# EAGLE design Diff_AMP (EAGLE 9.6.2)
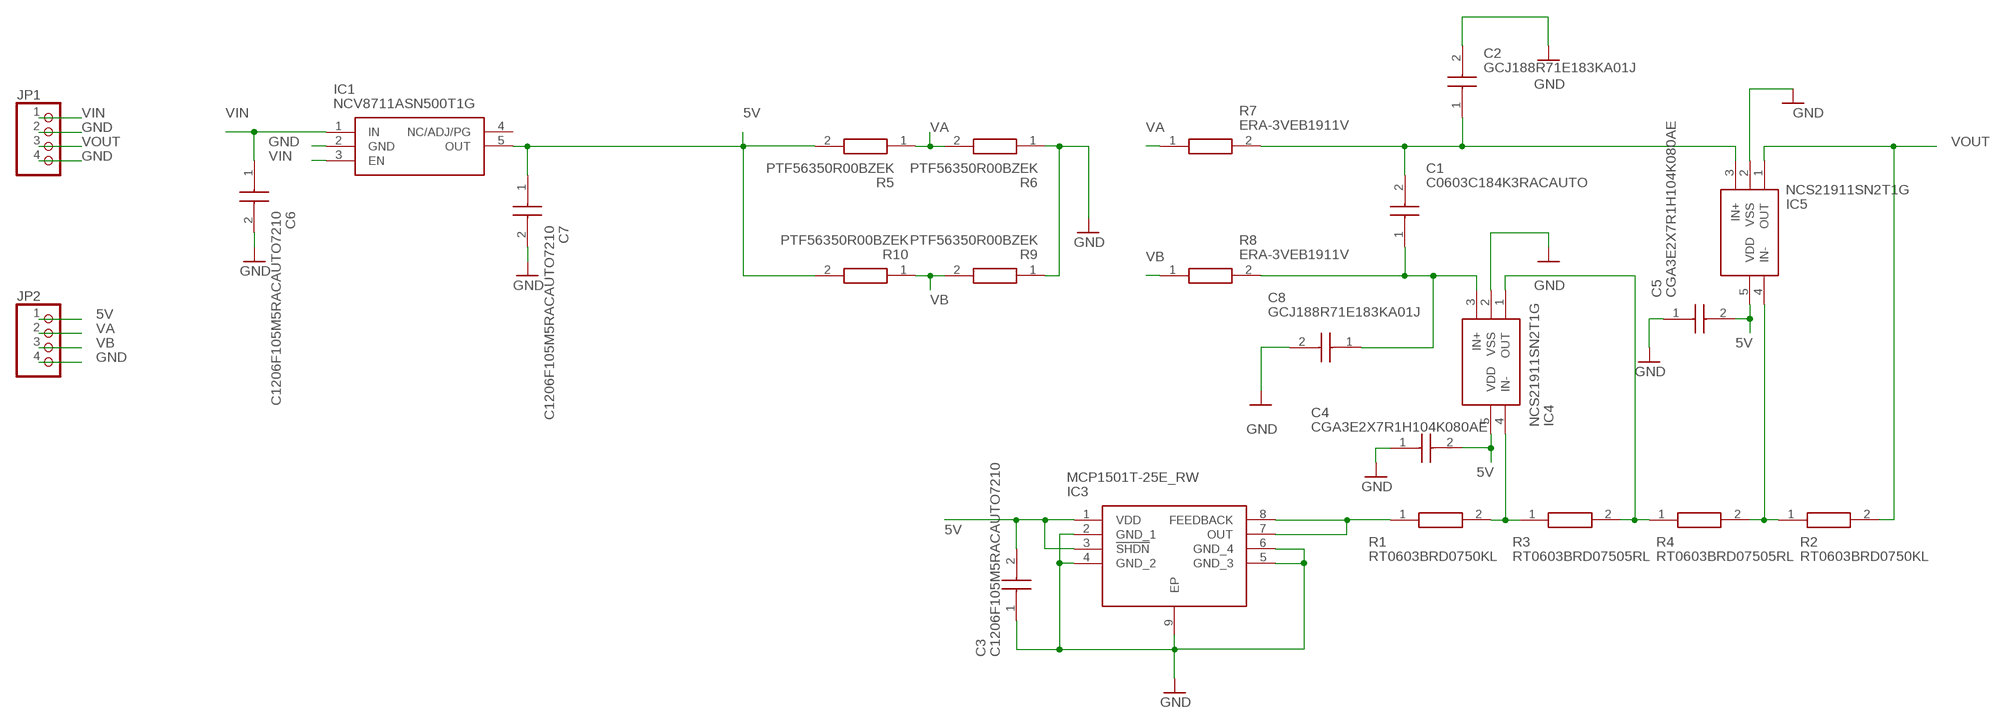
[diagram p0: schematic, sheet 1]

## Parts
C1  C0603C184K3RACAUTO  [C0603]
C2  GCJ188R71E183KA01J  [CAPC1608X100N]
C3  C1206F105M5RACAUTO7210  [C1206]
C4  CGA3E2X7R1H104K080AE  [CAPC1608X90N]
C5  CGA3E2X7R1H104K080AE  [CAPC1608X90N]
C6  C1206F105M5RACAUTO7210  [C1206]
C7  C1206F105M5RACAUTO7210  [C1206]
C8  GCJ188R71E183KA01J  [CAPC1608X100N]
IC1  NCV8711ASN500T1G  [SOT95P275X110-5N]
IC3  MCP1501T-25E_RW  [SON50P200X200X80-9N]
IC4  NCS21911SN2T1G  [SOT95P275X110-5N]
IC5  NCS21911SN2T1G  [SOT95P275X110-5N]
JP1  PINHD-1X4  [1X04]
JP2  PINHD-1X4  [1X04]
R1  RT0603BRD0750KL  [RESC1608X55N]
R2  RT0603BRD0750KL  [RESC1608X55N]
R3  RT0603BRD07505RL  [RESC1608X55N]
R4  RT0603BRD07505RL  [RESC1608X55N]
R5  PTF56350R00BZEK  [RESAD1559W64L635D231]
R6  PTF56350R00BZEK  [RESAD1559W64L635D231]
R7  ERA-3VEB1911V  [ERA3KV_(0603)]
R8  ERA-3VEB1911V  [ERA3KV_(0603)]
R9  PTF56350R00BZEK  [RESAD1559W64L635D231]
R10  PTF56350R00BZEK  [RESAD1559W64L635D231]

## Nets
5V: C3.2 C4.2 C5.2 C7.1 IC1.5(OUT) IC3.1(VDD) IC3.3(!SHDN) IC4.5(VDD) IC5.5(VDD) JP2.1 R5.2 R10.2
GND: C2.2 C3.1 C4.1 C5.1 C6.2 C7.2 C8.2 IC1.2(GND) IC3.2(GND_1) IC3.4(GND_2) IC3.5(GND_3) IC3.6(GND_4) IC3.9(EP) IC4.2(VSS) IC5.2(VSS) JP1.2 JP1.4 JP2.4 R6.1 R9.1
N$1: IC3.7(OUT) IC3.8(FEEDBACK) R1.1
N$2: IC4.4(IN-) R1.2 R3.1
N$3: C1.1 C8.1 IC4.3(IN+) R8.2
N$9: C1.2 C2.1 IC5.3(IN+) R7.2
N$12: IC4.1(OUT) R3.2 R4.1
N$13: IC5.4(IN-) R2.1 R4.2
VA: JP2.2 R5.1 R6.2 R7.1
VB: JP2.3 R8.1 R9.2 R10.1
VIN: C6.1 IC1.1(IN) IC1.3(EN) JP1.1
VOUT: IC5.1(OUT) JP1.3 R2.2
Unconnected: IC1.4(NC/ADJ/PG)

## Library data of the parts
C1 = SamacSys_Parts:C0603C184K3RACAUTO: SMD Auto X7R, Ceramic, 0.18 uF, 10%, 25 VDC, 62.5 VDC, 125?C, -55?C, X7R, SMD, MLCC, Temperature Stable, Automotive Grade, 3.5 % , 2.7778 GOhms, 4.8 mg, 0603, 1.6mm, 0.8mm, 0.8mm, 0.7mm, 0.35mm, 4000, 78 Weeks, 80 Source: Datasheet <https://content.kemet.com/datasheets/KEM_C1023_X7R_AUTO_SMD.pdf>; DESCRIPTION: SMD Auto X7R, Ceramic, 0.18 uF, 10%, 25 VDC, 62.5 VDC, 125?C, -55?C, X7R, SMD, MLCC, Temperature Stable, Automotive Grade, 3.5 % , 2.7778 GOhms, 4.8 mg, 0603, 1.6mm, 0.8mm, 0.8mm, 0.7mm, 0.35mm, 4000, 78 Weeks, 80; HEIGHT: 0.87mm; MANUFACTURER_NAME: KEMET; MANUFACTURER_PART_NUMBER: C0603C184K3RACAUTO; MOUSER_PART_NUMBER: 80-C0603C184K3RAUTO; MOUSER_PRICE-STOCK: https://www.mouser.co.uk/ProductDetail/KEMET/C0603C184K3RACAUTO?qs=u4fy%2FsgLU9MEpDJmNL66Jg%3D%3D
C2 C8 = SamacSys_Parts:GCJ188R71E183KA01J: Capacitor GCJ18 L=1.6mm W=0.8mm T=0.8mm Source: Datasheet <https://componentsearchengine.com/Datasheets/1/GCJ188R71E183KA01J.pdf>; DESCRIPTION: Capacitor GCJ18 L=1.6mm W=0.8mm T=0.8mm; HEIGHT: 1mm; MANUFACTURER_NAME: Murata Electronics; MANUFACTURER_PART_NUMBER: GCJ188R71E183KA01J; MOUSER_PART_NUMBER: 81-GCJ188R71E183KA1J; MOUSER_PRICE-STOCK: https://www.mouser.com/Search/Refine.aspx?Keyword=81-GCJ188R71E183KA1J
C3 C6 C7 = SamacSys_Parts:C1206F105M5RACAUTO7210: SMD Auto X7R FO, Ceramic, 1 uF, 20%, 50 VDC, 125 VDC, 125?C, -55?C, X7R, SMD, MLCC, Open Mode, Automotive Grade, 2.5 % , 500 MOhms, 41 mg, 1206, 3.2mm, 1.6mm, 1.6mm, 0.5mm, 8000, 78 Weeks, 80 Source: Datasheet <https://content.kemet.com/datasheets/KEM_C1012_X7R_OPENMODE_SMD.pdf>; DESCRIPTION: SMD Auto X7R FO, Ceramic, 1 uF, 20%, 50 VDC, 125 VDC, 125?C, -55?C, X7R, SMD, MLCC, Open Mode, Automotive Grade, 2.5 % , 500 MOhms, 41 mg, 1206, 3.2mm, 1.6mm, 1.6mm, 0.5mm, 8000, 78 Weeks, 80; HEIGHT: mm; MANUFACTURER_NAME: KEMET; MANUFACTURER_PART_NUMBER: C1206F105M5RACAUTO7210; MOUSER_PART_NUMBER: 80-C1206F105M5RAUTLR; MOUSER_PRICE-STOCK: https://www.mouser.co.uk/ProductDetail/KEMET/C1206F105M5RACAUTO7210?qs=ds50AKTGxA8F1MxATCT6sg%3D%3D
C4 C5 = SamacSys_Parts:CGA3E2X7R1H104K080AE: Source: Datasheet; HEIGHT: 0.9mm; MANUFACTURER_NAME: TDK; MANUFACTURER_PART_NUMBER: CGA3E2X7R1H104K080AE; MOUSER_PART_NUMBER: 810-CGA3E2X7R1H104KE; MOUSER_PRICE-STOCK: https://www.mouser.co.uk/ProductDetail/TDK/CGA3E2X7R1H104K080AE?qs=n%2FVzw7c4a0kvajqFvEbDzQ%3D%3D
IC1 = SamacSys_Parts:NCV8711ASN500T1G: LDO Voltage Regulators NCV8711 TSOP-5 5V0 Source: Datasheet <https://www.onsemi.com/pdf/datasheet/ncv8711-d.pdf>; DESCRIPTION: LDO Voltage Regulators NCV8711 TSOP-5 5V0; HEIGHT: 1.1mm; MANUFACTURER_NAME: onsemi; MANUFACTURER_PART_NUMBER: NCV8711ASN500T1G; MOUSER_PART_NUMBER: 863-NCV8711ASN500T1G; MOUSER_PRICE-STOCK: https://www.mouser.co.uk/ProductDetail/onsemi/NCV8711ASN500T1G?qs=W%2FMpXkg%252BdQ7j9dl81WfXeA%3D%3D
IC3 = SamacSys_Parts:MCP1501T-25E_RW: Voltage References High Prec Buffered Voltage Reference Source: Datasheet <http://ww1.microchip.com/downloads/en/DeviceDoc/20005474E.pdf>; DESCRIPTION: Voltage References High Prec Buffered Voltage Reference; HEIGHT: 0.8mm; MANUFACTURER_NAME: Microchip; MANUFACTURER_PART_NUMBER: MCP1501T-25E/RW; MOUSER_PART_NUMBER: 579-MCP1501T-25E/RW; MOUSER_PRICE-STOCK: https://www.mouser.co.uk/ProductDetail/Microchip-Technology/MCP1501T-25E-RW?qs=BA62vJVifGo7hml43fG32Q%3D%3D
IC4 IC5 = SamacSys_Parts:NCS21911SN2T1G: Operational Amplifiers - Op Amps 2 MHz Source: Datasheet <https://www.arrow.com/en/products/ncs21911sn2t1g/on-semiconductor>; DESCRIPTION: Operational Amplifiers - Op Amps 2 MHz; HEIGHT: 1.1mm; MANUFACTURER_NAME: ON Semiconductor; MANUFACTURER_PART_NUMBER: NCS21911SN2T1G; MOUSER_PART_NUMBER: 863-NCS21911SN2T1G; MOUSER_PRICE-STOCK: https://www.mouser.co.uk/ProductDetail/ON-Semiconductor/NCS21911SN2T1G/?qs=%252B6g0mu59x7Ix%2FTFBhvJ5Cw%3D%3D
JP1 JP2 = pinhead:PINHD-1X4: PIN HEADER
R1 R2 = SamacSys_Parts:RT0603BRD0750KL: Thin Film Resistors - SMD 50K ohm 0.1% 25 ppm High-Precision Source: Datasheet; DESCRIPTION: Thin Film Resistors - SMD 50K ohm 0.1% 25 ppm High-Precision; HEIGHT: 0.55mm; MANUFACTURER_NAME: KEMET; MANUFACTURER_PART_NUMBER: RT0603BRD0750KL; MOUSER_PART_NUMBER: 603-RT0603BRD0750KL; MOUSER_PRICE-STOCK: https://www.mouser.co.uk/ProductDetail/YAGEO/RT0603BRD0750KL?qs=qpJ%252B%252B%252Bdg6p2%2FJCmrad8NSA%3D%3D
R3 R4 = SamacSys_Parts:RT0603BRD07505RL: Thin Film Resistors - SMD 505 ohm 0.1% 25 ppm High-Precision Source: Datasheet; DESCRIPTION: Thin Film Resistors - SMD 1/10W 505 Ohms 0.1%; HEIGHT: 0.45 mm; MANUFACTURER_NAME: YAGEO; MANUFACTURER_PART_NUMBER: RT0603BRD07505RL; MOUSER_PART_NUMBER: 603-RT0603BRD07505RL; MOUSER_PRICE-STOCK: https://www.mouser.com/ProductDetail/YAGEO/RT0603BRD07505RL?qs=%2Ff7pOCXLR5cBSiUnANXXqg%3D%3D
R5 R6 R9 R10 = SamacSys_Parts:PTF56350R00BZEK: Vishay PTF56 Series Axial Metal Film Resistor 350 +/-0.1% 0.125W +/-5ppm/C Source: Datasheet <https://componentsearchengine.com/Datasheets/1/PTF56350R00BZEK.pdf>; DESCRIPTION: Vishay PTF56 Series Axial Metal Film Resistor 350 +/-0.1% 0.125W +/-5ppm/C; HEIGHT: mm; MANUFACTURER_NAME: Vishay; MANUFACTURER_PART_NUMBER: PTF56350R00BZEK; MOUSER_PART_NUMBER: 71-PTF56350R00BZEK; MOUSER_PRICE-STOCK: https://www.mouser.com/Search/Refine.aspx?Keyword=71-PTF56350R00BZEK
R7 R8 = SamacSys_Parts:ERA-3VEB1911V: Chip Resistor 0603 (1608 Metric) Anti-Sulfur, Automotive AEC-Q200 Thin Film Source: Datasheet <http://industrial.panasonic.com/cdbs/www-data/pdf/RDM0000/RDM0000C331.pdf>; DESCRIPTION: Chip Resistor 0603 (1608 Metric) Anti-Sulfur, Automotive AEC-Q200 Thin Film; HEIGHT: 0.4mm; MANUFACTURER_NAME: Panasonic; MANUFACTURER_PART_NUMBER: ERA-3VEB1911V; MOUSER_PART_NUMBER: 667-ERA-3VEB1911V; MOUSER_PRICE-STOCK: https://www.mouser.co.uk/ProductDetail/Panasonic/ERA-3VEB1911V?qs=OlC7AqGiEDmVeEFNDv62ZQ%3D%3D

## Board
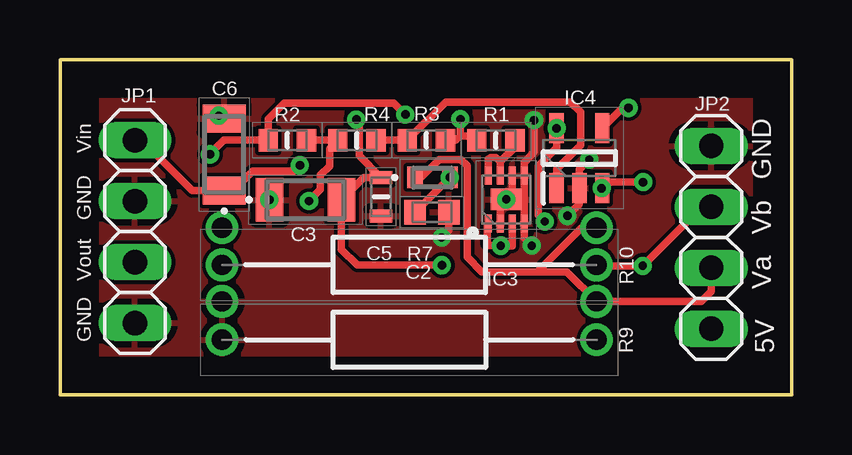
[diagram p1: board, top side]
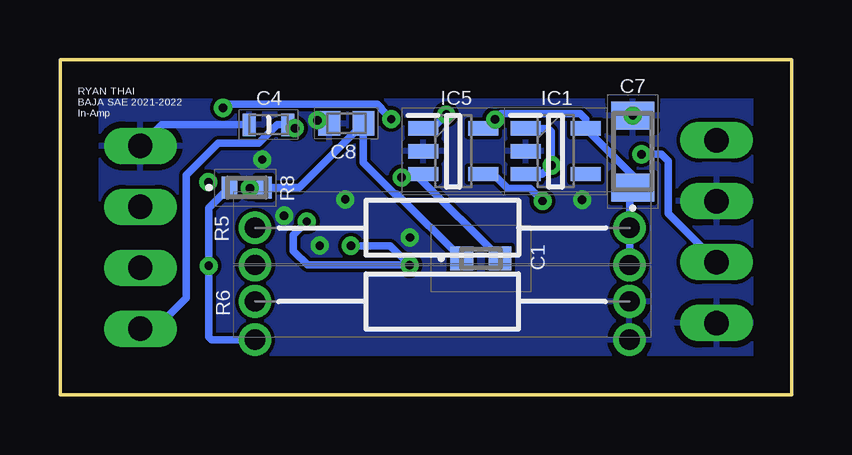
[diagram p2: board, bottom side, seen from below]

Size 30.48 x 13.97 mm. Coordinates in mm from the lower left corner, seen from the top.
Outline: 0,0 30.48,0 30.48,13.97 0,13.97 0,0
Copper layers (1*16): Top 0.035mm / dielectric 1.5mm / Bottom 0.035mm
Design rules "default *": minimum track width 6mil, minimum drill 0.35mm, track to track 6mil, track to pad 6mil, pad to pad 6mil, via to via 6mil, smd to smd 6mil, copper to edge 60mil, drill to drill 6mil, minimum pad ring 10mil, minimum via ring 8mil, stop-mask expansion 4mil, vias tented up to drill 20mil, thermal gap 10mil

### Footprints (pad centres in the part's own frame; a part is rotated, then mirrored left to right if it is on the bottom)
C0603 = smd 0.95 x 1: 1 -0.8,0; 2 0.8,0
CAPC1608X100N = smd 0.9 x 1.02: 1 -0.71,0; 2 0.71,0
C1206 = smd 1.15 x 1.8: 1 -1.5,0; 2 1.5,0
CAPC1608X90N = smd 0.54 x 0.94: 1 -0.8,0; 2 0.8,0
SOT95P275X110-5N = smd 1.25 x 0.6: 1 -1.25,0.95; 2 -1.25,0; 3 -1.25,-0.95; 4 1.25,-0.95; 5 1.25,0.95
SON50P200X200X80-9N = smd 0.75 x 0.3: 1 -1,0.75; 2 -1,0.25; 3 -1,-0.25; 4 -1,-0.75; 5 1,-0.75; 6 1,-0.25; 7 1,0.25; 8 1,0.75 | smd 0.9 x 1.3: 9 0,0
1X04 = drill 1.016 long: 1 -3.81,0; 2 -1.27,0; 3 1.27,0; 4 3.81,0
RESC1608X55N = smd 0.8 x 0.95: 1 -0.8,0; 2 0.8,0
RESAD1559W64L635D231 = drill 0.85 pad 1.275: 1 0,0; 2 15.6,0
ERA3KV_(0603) = smd 0.65 x 0.9: 1 -0.725,-0.025; 2 0.725,-0.025

### Placement (x,y rotation side)
C1  12.95,5.69 0 bottom
C2  15.49,7.62 0 top
C3  10.23,8.14 0 top
C4  21.79,11.27 0 bottom
C5  13.37,8.26 90 top
C6  6.84,10.02 90 top
C7  6.62,10.15 90 bottom
C8  18.55,11.32 180 bottom
IC1  9.83,10.16 0 bottom
IC3  18.59,8.15 90 top
IC4  21.64,9.87 90 top
IC5  14.1,10.16 0 bottom
JP1  3.12,6.81 270 top
JP2  27.13,6.57 90 top
R1  18.16,10.62 180 top
R2  9.47,10.62 180 top
R3  15.27,10.62 180 top
R4  12.37,10.62 180 top
R5  22.35,6.97 0 bottom
R6  6.75,3.9 180 bottom
R7  15.52,9.09 0 top
R8  22.7,8.67 0 bottom
R9  6.75,2.3 0 top
R10  22.35,5.42 180 top

### Tracks (layer width: path | path; a pad name or v marks a point on that pad's centre or on a via)
5V  (via drill 0.35)
  Top 0.305: v12.35,11.49 12.35,11.34 12.46,11.22 12.46,9.97 C5.2 12.65,9.06 C3.2 11.72,6.07 12.38,5.41 v15.91,5.41 | IC3.3 18.84,6.22 v18.36,6.22 18.35,6.24 17.88,6.24 17.8,6.32 17.8,7.11 IC3.1 | v20.2,7.23 19.92,7.5 19.92,9.55 20.69,10.32 IC4.5
  Bottom 0.305: R10.2 R5.2 6.75,8.51 C7.1 6.62,9.14 IC1.5 8.58,11.5 8.81,11.73 12.11,11.73 v12.35,11.49 12.47,11.49 IC5.5 | IC4.5 20.84,11.12 C4.2 21.42,11.27 22.2,10.5 23.9,10.5 25.22,9.17 25.22,4.05 26.51,2.76 JP2.1 | v18.36,6.22 16.72,6.22 v15.91,5.41 20.15,5.41 20.75,6.01 20.75,6.68 v20.2,7.23
  other vias: 20.69,11.12
GND  (via drill 0.35)
  Top 0.305: 19.34,8.15 IC3.4 19.34,6.54 v19.66,6.23 | 19.34,8.15 IC3.5 19.34,9.69 19.67,10.02 19.67,10.04 19.75,10.13 v19.75,11.45 | IC3.9 18.84,8.4 IC3.6 | IC3.9 19.34,8.15 | C6.2 6.71,11.64 C7.2 | v21.14,7.47 21.64,7.97 IC4.2 21.64,9.4 v22.05,9.81 | IC3.2 18.34,7.9 IC3.9 | C2.2 16.2,6.87 v15.9,6.56
  Bottom 0.305: C8.2 19.39,11.45 v19.75,11.45 | C4.1 26.24,11.27 JP2.4
  other vias: 18.59,8.15 6.62,11.65 8.73,8.14
  pour Bottom: -0.15,14.05 30.52,14.05 30.49,0 -0.03,0 -0.03,0
  pour Top: 0.03,13.87 0.03,0 30.51,0 30.51,13.94 0.05,13.94 0.05,13.79
N$1
  Top 0.305: IC3.8 17.84,9.83 17.85,9.84 17.89,9.84 17.96,9.91 18.16,9.91 18.34,9.72 | 18.34,9.72 IC3.7 | 18.34,9.72 18.96,10.34 R1.1
N$2  (via drill 0.35)
  Top 0.305: IC4.4 23.44,11.97 v23.69,11.97 | v16.68,11.5 16.68,10.8 | R3.1 16.5,10.62 16.68,10.8 | 16.68,10.8 17.18,10.8 R1.2
  Bottom 0.305: v23.69,11.97 23.52,12.14 17.26,12.14 17.09,11.96 17.09,11.91 v16.68,11.5
N$3  (via drill 0.35)
  Top 0.305: v24.3,8.87 22.84,8.87 IC4.3 v22.57,8.62
  Bottom 0.305: R8.2 20.51,8.65 C8.1 17.84,9.7 16.53,8.38 16.44,8.38 C1.1 | R8.2 22.54,8.65 v22.57,8.62 22,8.62 R8.2
N$9  (via drill 0.35)
  Top 0.305: C2.1 14.8,7.62 R7.2
  Bottom 0.305: IC5.3 16.1,9.21 R7.2 15.53,9.07 C1.2
  other vias: 16.24,9.07
N$12
  Top 0.305: R4.1 R3.2 16.07,12.22 21.26,12.22 21.69,11.79 21.69,10.42 20.69,9.42 IC4.1
N$13  (via drill 0.35)
  Top 0.305: v10.37,8.09 10.85,8.56 10.85,9.16 11.23,9.55 11.23,10.28 R4.2 R2.1
  Bottom 0.305: v10.37,8.09 10.89,8.6 11.83,8.6 12.44,9.21 IC5.4
VA
  Top 0.305: R7.1 15.04,9.07 15.79,9.82 16.7,9.82 16.96,9.56 16.96,5.75 17.58,5.13 19.89,5.13 | R5.1 21.73,6.97 19.89,5.13 | 19.89,5.13 21.12,5.13 R6.2 26.71,3.9 27.14,4.32 JP2.2
VB  (via drill 0.35)
  Top 0.305: JP2.3 26.74,7.84 v24.28,5.38 22.39,5.38 R10.1
  Bottom 0.305: R9.2 24.16,2.29 24.28,2.42 v24.28,5.38 24.28,7.08 24.28,7.15 24.28,7.79 R8.1
VIN  (via drill 0.35)
  Top 0.305: v9.99,9.57 9.76,9.34 8.02,9.34 7.21,8.52 C6.1 5.5,8.52 3.41,10.62 JP1.1
  Bottom 0.305: IC1.1 10.14,11.11 10.01,10.98 10.01,9.59 | IC1.3 10.39,9.21 10.01,9.59 | 10.01,9.59 v9.99,9.57
VOUT  (via drill 0.35)
  Top 0.305: v6.25,10.03 6.83,10.62 R2.2 8.67,11.51 9.33,12.17 13.91,12.17 v14.39,11.69
  Bottom 0.305: JP1.3 5.14,7.56 5.14,9.76 5.42,10.03 v6.25,10.03 | v14.39,11.69 14.97,11.11 IC5.1

### Text on the board
tNames: Vin | GND | GND | Vb | Vout | Va | GND | 5V
bNames: RYAN THAI / BAJA SAE 2021-2022 / In-Amp